# EAGLE design Digitizer10Bits (EAGLE 5.11)

## Sheet 1 of 4
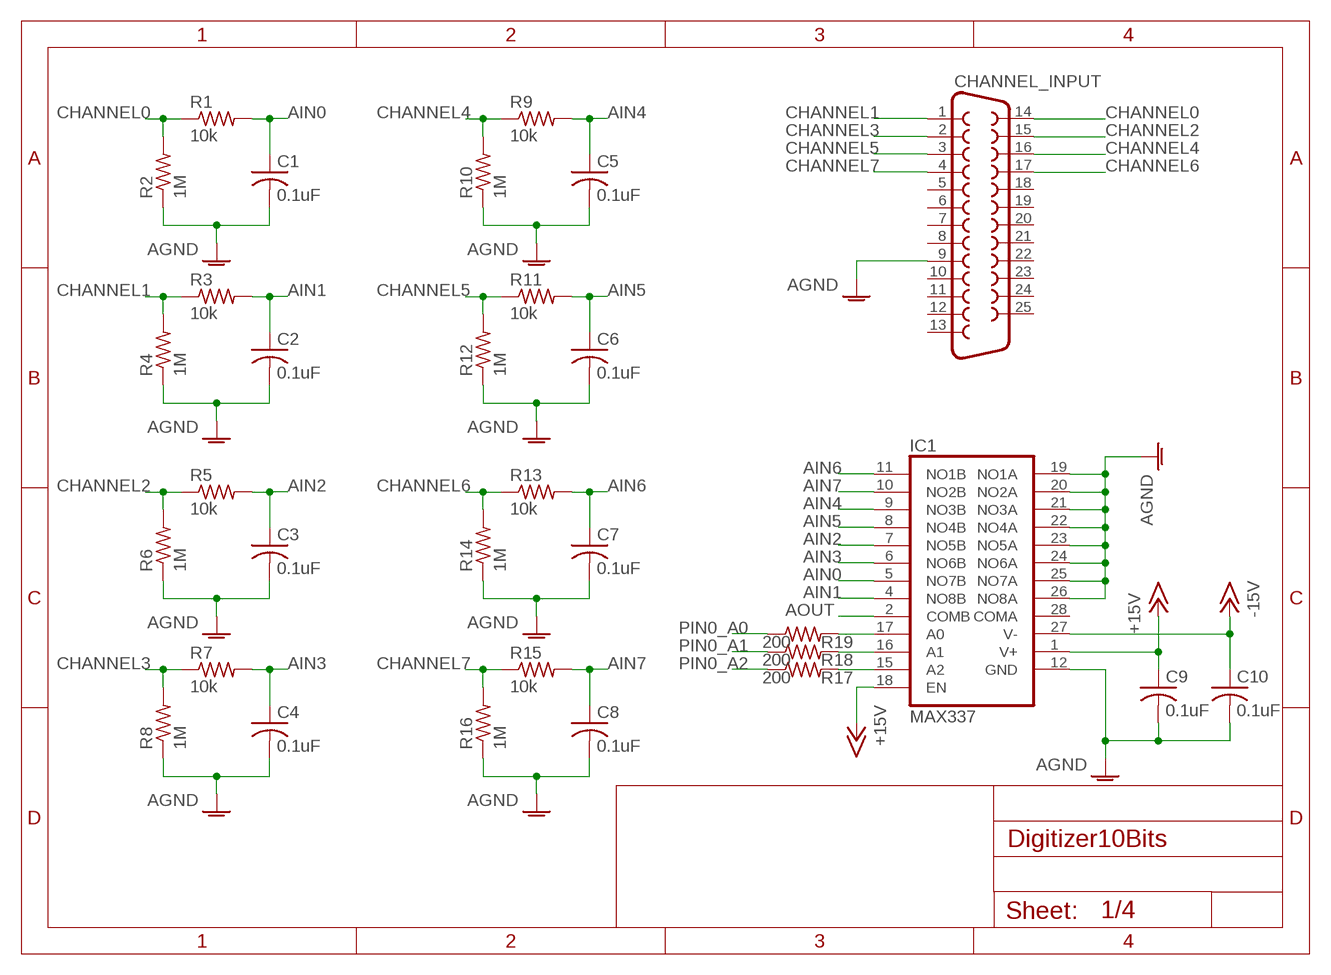
[diagram p0: schematic, sheet 1]

### Parts
C1  0.1uF  C-USC0603  [C0603]
C2  0.1uF  C-USC0603  [C0603]
C3  0.1uF  C-USC0603  [C0603]
C4  0.1uF  C-USC0603  [C0603]
C5  0.1uF  C-USC0603  [C0603]
C6  0.1uF  C-USC0603  [C0603]
C7  0.1uF  C-USC0603  [C0603]
C8  0.1uF  C-USC0603  [C0603]
C9  0.1uF  C-USC0603  [C0603]
C10  0.1uF  C-USC0603  [C0603]
CHANNEL_INPUT  F25HP  [F25HP]
IC1  MAX337  [SSOP28]
R1  10k  R-US_R0603  [R0603]
R2  1M  R-US_R0603  [R0603]
R3  10k  R-US_R0603  [R0603]
R4  1M  R-US_R0603  [R0603]
R5  10k  R-US_R0603  [R0603]
R6  1M  R-US_R0603  [R0603]
R7  10k  R-US_R0603  [R0603]
R8  1M  R-US_R0603  [R0603]
R9  10k  R-US_R0603  [R0603]
R10  1M  R-US_R0603  [R0603]
R11  10k  R-US_R0603  [R0603]
R12  1M  R-US_R0603  [R0603]
R13  10k  R-US_R0603  [R0603]
R14  1M  R-US_R0603  [R0603]
R15  10k  R-US_R0603  [R0603]
R16  1M  R-US_R0603  [R0603]
R17  200  R-US_R0603  [R0603]
R18  200  R-US_R0603  [R0603]
R19  200  R-US_R0603  [R0603]

### Nets
+15V: C9.1 IC1.1(V+) IC1.18(EN) ; also sheet 2,3
-15V: C10.1 IC1.27(V-) ; also sheet 2,3
AGND: C1.2 C2.2 C3.2 C4.2 C5.2 C6.2 C7.2 C8.2 C9.2 C10.2 CHANNEL_INPUT.9 IC1.12(GND) IC1.19(NO1A) IC1.20(NO2A) IC1.21(NO3A) IC1.22(NO4A) IC1.23(NO5A) IC1.24(NO6A) IC1.25(NO7A) IC1.26(NO8A) R2.1 R4.1 R6.1 R8.1 R10.1 R12.1 R14.1 R16.1 ; also sheet 2,3
AIN0: C1.1 IC1.5(NO7B) R1.2
AIN1: C2.1 IC1.4(NO8B) R3.2
AIN2: C3.1 IC1.7(NO5B) R5.2
AIN3: C4.1 IC1.6(NO6B) R7.2
AIN4: C5.1 IC1.9(NO3B) R9.2
AIN5: C6.1 IC1.8(NO4B) R11.2
AIN6: C7.1 IC1.11(NO1B) R13.2
AIN7: C8.1 IC1.10(NO2B) R15.2
AOUT: IC1.2(COMB) ; also sheet 3
CHANNEL0: CHANNEL_INPUT.14 R1.1 R2.2
CHANNEL1: CHANNEL_INPUT.1 R3.1 R4.2
CHANNEL2: CHANNEL_INPUT.15 R5.1 R6.2
CHANNEL3: CHANNEL_INPUT.2 R7.1 R8.2
CHANNEL4: CHANNEL_INPUT.16 R9.1 R10.2
CHANNEL5: CHANNEL_INPUT.3 R11.1 R12.2
CHANNEL6: CHANNEL_INPUT.17 R13.1 R14.2
CHANNEL7: CHANNEL_INPUT.4 R15.1 R16.2
N$1: IC1.15(A2) R17.2
N$2: IC1.16(A1) R18.2
N$3: IC1.17(A0) R19.2
PIN0_A0: R19.1 ; also sheet 3
PIN0_A1: R18.1 ; also sheet 3
PIN0_A2: R17.1 ; also sheet 3
Unconnected: CHANNEL_INPUT.5 CHANNEL_INPUT.6 CHANNEL_INPUT.7 CHANNEL_INPUT.8 CHANNEL_INPUT.10 CHANNEL_INPUT.11 CHANNEL_INPUT.12 CHANNEL_INPUT.13 CHANNEL_INPUT.18 CHANNEL_INPUT.19 CHANNEL_INPUT.20 CHANNEL_INPUT.21 CHANNEL_INPUT.22 CHANNEL_INPUT.23 CHANNEL_INPUT.24 CHANNEL_INPUT.25 IC1.28(COMA)

## Sheet 2 of 4
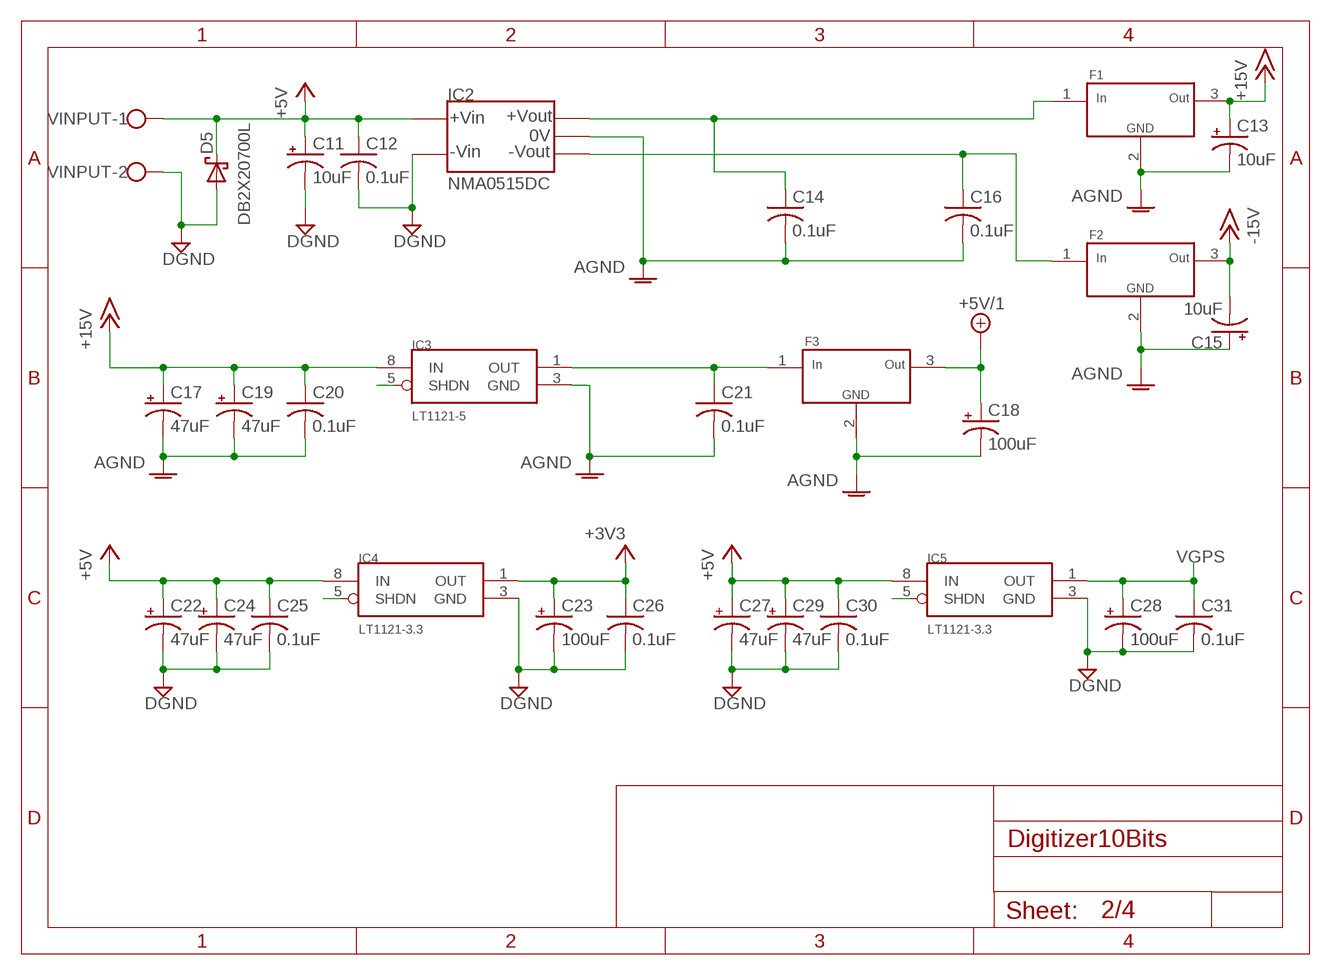
[diagram p1: schematic, sheet 2]

### Parts
C11  10uF  CPOL-USA/3216-18W  [A/3216-18W]
C12  0.1uF  C-USC0603  [C0603]
C13  10uF  CPOL-USA/3216-18W  [A/3216-18W]
C14  0.1uF  C-USC0603  [C0603]
C15  10uF  CPOL-USA/3216-18W  [A/3216-18W]
C16  0.1uF  C-USC0603  [C0603]
C17  47uF  CPOL-USE  [PANASONIC_E]
C18  100uF  CPOL-USE  [PANASONIC_E]
C19  47uF  CPOL-USE  [PANASONIC_E]
C20  0.1uF  C-USC0603  [C0603]
C21  0.1uF  C-USC0603  [C0603]
C22  47uF  CPOL-USE  [PANASONIC_E]
C23  100uF  CPOL-USE  [PANASONIC_E]
C24  47uF  CPOL-USE  [PANASONIC_E]
C25  0.1uF  C-USC0603  [C0603]
C26  0.1uF  C-USC0603  [C0603]
C27  47uF  CPOL-USE  [PANASONIC_E]
C28  100uF  CPOL-USE  [PANASONIC_E]
C29  47uF  CPOL-USE  [PANASONIC_E]
C30  0.1uF  C-USC0603  [C0603]
C31  0.1uF  C-USC0603  [C0603]
D5  DB2X20700L  SCHOTTKY_SMD  [DIODE_PW]
F1  EMIFIL  [NFE-2706]
F2  EMIFIL  [NFE-2706]
F3  EMIFIL  [NFE-2706]
IC2  NMA0515DC  NMA1512DC  [NMA1512DC]
IC3  LT1121-5  LT1121-3.3  [SO08]
IC4  LT1121-3.3  [SO08]
IC5  LT1121-3.3  [SO08]
VINPUT  W237-102  [W237-102]

### Nets
+3V3: C23.+ C26.1 IC4.1(OUT) ; also sheet 3,4
+5V: C11.+ C12.1 C22.+ C24.+ C25.1 C27.+ C29.+ C30.1 D5.K(C) IC2.+VIN IC4.8(IN) IC5.8(IN) VINPUT.1
+5V/1: C18.+ F3.3 ; also sheet 3
+15V: C13.+ C17.+ C19.+ C20.1 F1.3 IC3.8(IN) ; also sheet 1,3
-15V: C15.- F2.3 ; also sheet 1,3
AGND: C13.- C14.2 C15.+ C16.2 C17.- C18.- C19.- C20.2 C21.2 F1.2 F2.2 F3.2 IC2.0V IC3.3(GND) ; also sheet 1,3
DGND: C11.- C12.2 C22.- C23.- C24.- C25.2 C26.2 C27.- C28.- C29.- C30.2 C31.2 D5.A IC2.-VIN IC4.3(GND) IC5.3(GND) VINPUT.2 ; also sheet 3,4
N$24: IC3.5(SHDN)
N$39: C14.1 F1.1 IC2.+VOUT
N$40: C16.1 F2.1 IC2.-VOUT
N$42: C21.1 F3.1 IC3.1(OUT)
N$48: IC4.5(SHDN)
N$52: IC5.5(SHDN)
VGPS: C28.+ C31.1 IC5.1(OUT) ; also sheet 4

## Sheet 3 of 4
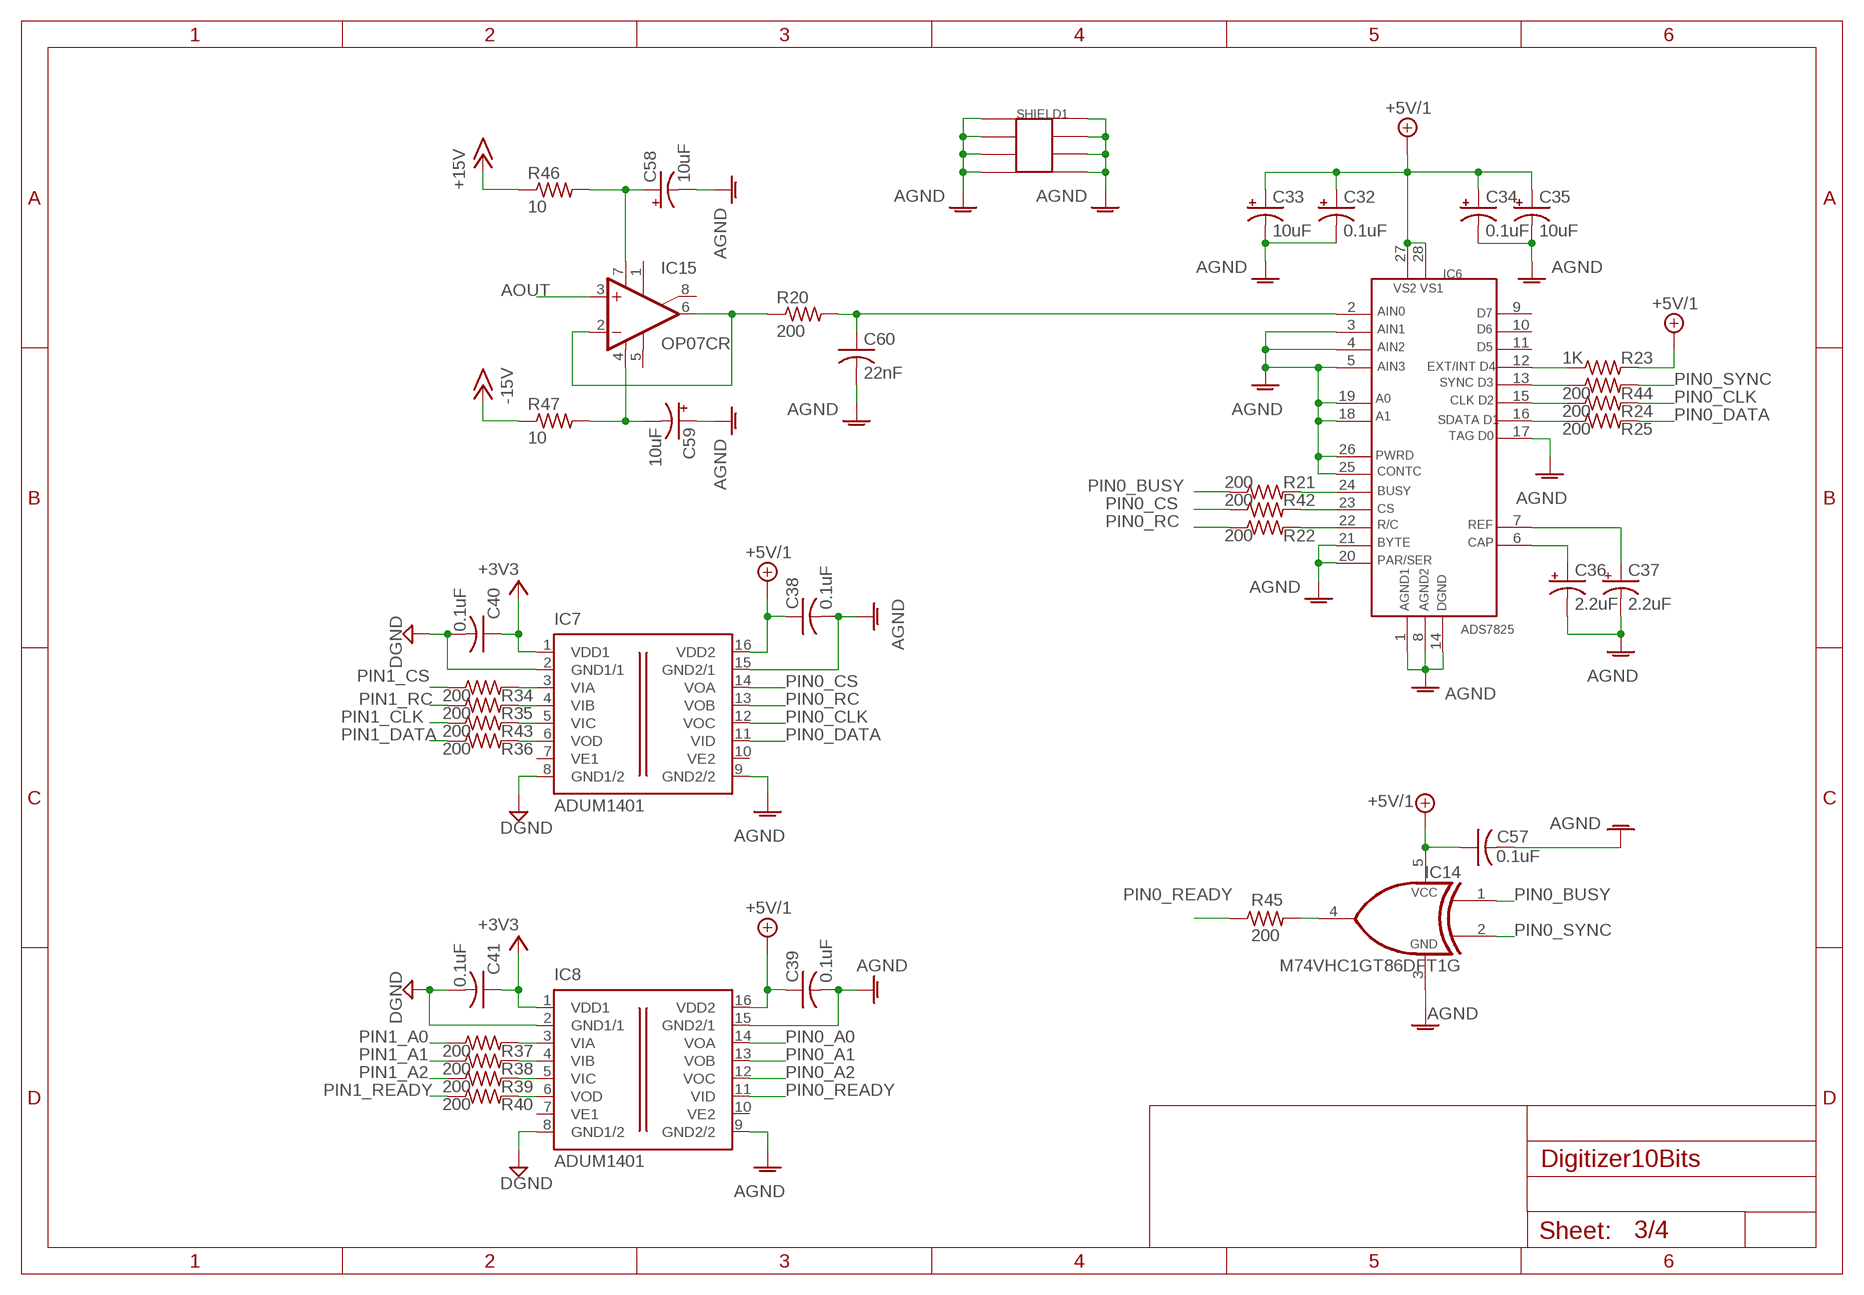
[diagram p2: schematic, sheet 3]

### Parts
C32  0.1uF  CPOL-USA/3216-18W  [A/3216-18W]
C33  10uF  CPOL-USA/3216-18W  [A/3216-18W]
C34  0.1uF  CPOL-USA/3216-18W  [A/3216-18W]
C35  10uF  CPOL-USA/3216-18W  [A/3216-18W]
C36  2.2uF  CPOL-USA/3216-18W  [A/3216-18W]
C37  2.2uF  CPOL-USA/3216-18W  [A/3216-18W]
C38  0.1uF  C-USC0603  [C0603]
C39  0.1uF  C-USC0603  [C0603]
C40  0.1uF  C-USC0603  [C0603]
C41  0.1uF  C-USC0603  [C0603]
C57  0.1uF  C-USC0603  [C0603]
C58  10uF  CPOL-USA/3216-18W  [A/3216-18W]
C59  10uF  CPOL-USA/3216-18W  [A/3216-18W]
C60  22nF  C-USC0603  [C0603]
IC6  ADS7825  [SOIC-28]
IC7  ADUM1401  [SO-16W]
IC8  ADUM1401  [SO-16W]
IC14  M74VHC1GT86DFT1G  M74GT86DFT1G  [SOT-353]
IC15  OP07CR  [SO08]
R20  200  R-US_R0603  [R0603]
R21  200  R-US_R0603  [R0603]
R22  200  R-US_R0603  [R0603]
R23  1K  R-US_R0603  [R0603]
R24  200  R-US_R0603  [R0603]
R25  200  R-US_R0603  [R0603]
R34  200  R-US_R0603  [R0603]
R35  200  R-US_R0603  [R0603]
R36  200  R-US_R0603  [R0603]
R37  200  R-US_R0603  [R0603]
R38  200  R-US_R0603  [R0603]
R39  200  R-US_R0603  [R0603]
R40  200  R-US_R0603  [R0603]
R42  200  R-US_R0603  [R0603]
R43  200  R-US_R0603  [R0603]
R44  200  R-US_R0603  [R0603]
R45  200  R-US_R0603  [R0603]
R46  10  R-US_R0805  [R0805]
R47  10  R-US_R0805  [R0805]
SHIELD1  SHIELD_50X38  [SHIELD_38X50]

### Nets
+3V3: C40.1 C41.1 IC7.1(VDD1) IC8.1(VDD1) ; also sheet 2,4
+5V/1: C32.+ C33.+ C34.+ C35.+ C38.1 C39.1 C57.1 IC6.27 IC6.28 IC7.16(VDD2) IC8.16(VDD2) IC14.5 R23.2 ; also sheet 2
+15V: R46.1 ; also sheet 1,2
-15V: R47.1 ; also sheet 1,2
AGND: C32.- C33.- C34.- C35.- C36.- C37.- C38.2 C39.2 C57.2 C58.- C59.+ C60.2 IC6.1 IC6.3 IC6.4 IC6.5 IC6.8 IC6.14 IC6.17 IC6.18 IC6.19 IC6.20 IC6.21 IC6.25 IC6.26 IC7.9(GND2/2) IC7.15(GND2/1) IC8.9(GND2/2) IC8.15(GND2/1) IC14.3 SHIELD1.P$1 SHIELD1.P$2 SHIELD1.P$3 SHIELD1.P$4 SHIELD1.P$5 SHIELD1.P$6 SHIELD1.P$7 SHIELD1.P$8 ; also sheet 1,2
AOUT: IC15.3(+IN) ; also sheet 1
DGND: C40.2 C41.2 IC7.2(GND1/1) IC7.8(GND1/2) IC8.2(GND1/1) IC8.8(GND1/2) ; also sheet 2,4
N$4: IC6.24 R21.2
N$6: IC6.22 R22.2
N$7: C60.1 IC6.2 R20.2
N$12: IC6.12 R23.1
N$13: IC6.15 R24.1
N$14: IC6.16 R25.1
N$17: C36.+ IC6.6
N$18: C37.+ IC6.7
N$28: IC7.3(VIA) R34.2
N$29: IC7.4(VIB) R35.2
N$30: IC7.6(VOD) R36.2
N$31: IC8.3(VIA) R37.2
N$32: IC8.4(VIB) R38.2
N$33: IC8.5(VIC) R39.2
N$34: IC8.6(VOD) R40.2
N$37: C59.- IC15.4(V-) R47.2
N$41: IC6.23 R42.2
N$43: IC7.5(VIC) R43.2
N$44: IC14.4 R45.2
N$45: C58.+ IC15.7(V+) R46.2
N$46: IC6.13 R44.1
N$47: IC15.2(-IN) IC15.6(OUT) R20.1
PIN0_A0: IC8.14(VOA) ; also sheet 1
PIN0_A1: IC8.13(VOB) ; also sheet 1
PIN0_A2: IC8.12(VOC) ; also sheet 1
PIN0_BUSY: IC14.1 R21.1
PIN0_CLK: IC7.12(VOC) R24.2
PIN0_CS: IC7.14(VOA) R42.1
PIN0_DATA: IC7.11(VID) R25.2
PIN0_RC: IC7.13(VOB) R22.1
PIN0_READY: IC8.11(VID) R45.1
PIN0_SYNC: IC14.2 R44.2
PIN1_A0: R37.1 ; also sheet 4
PIN1_A1: R38.1 ; also sheet 4
PIN1_A2: R39.1 ; also sheet 4
PIN1_CLK: R43.1 ; also sheet 4
PIN1_CS: R34.1 ; also sheet 4
PIN1_DATA: R36.1 ; also sheet 4
PIN1_RC: R35.1 ; also sheet 4
PIN1_READY: R40.1 ; also sheet 4
Unconnected: IC6.9 IC6.10 IC6.11 IC7.7(VE1) IC7.10(VE2) IC8.7(VE1) IC8.10(VE2) IC15.1(ON1) IC15.5(OPT) IC15.8(ON2)

## Sheet 4 of 4
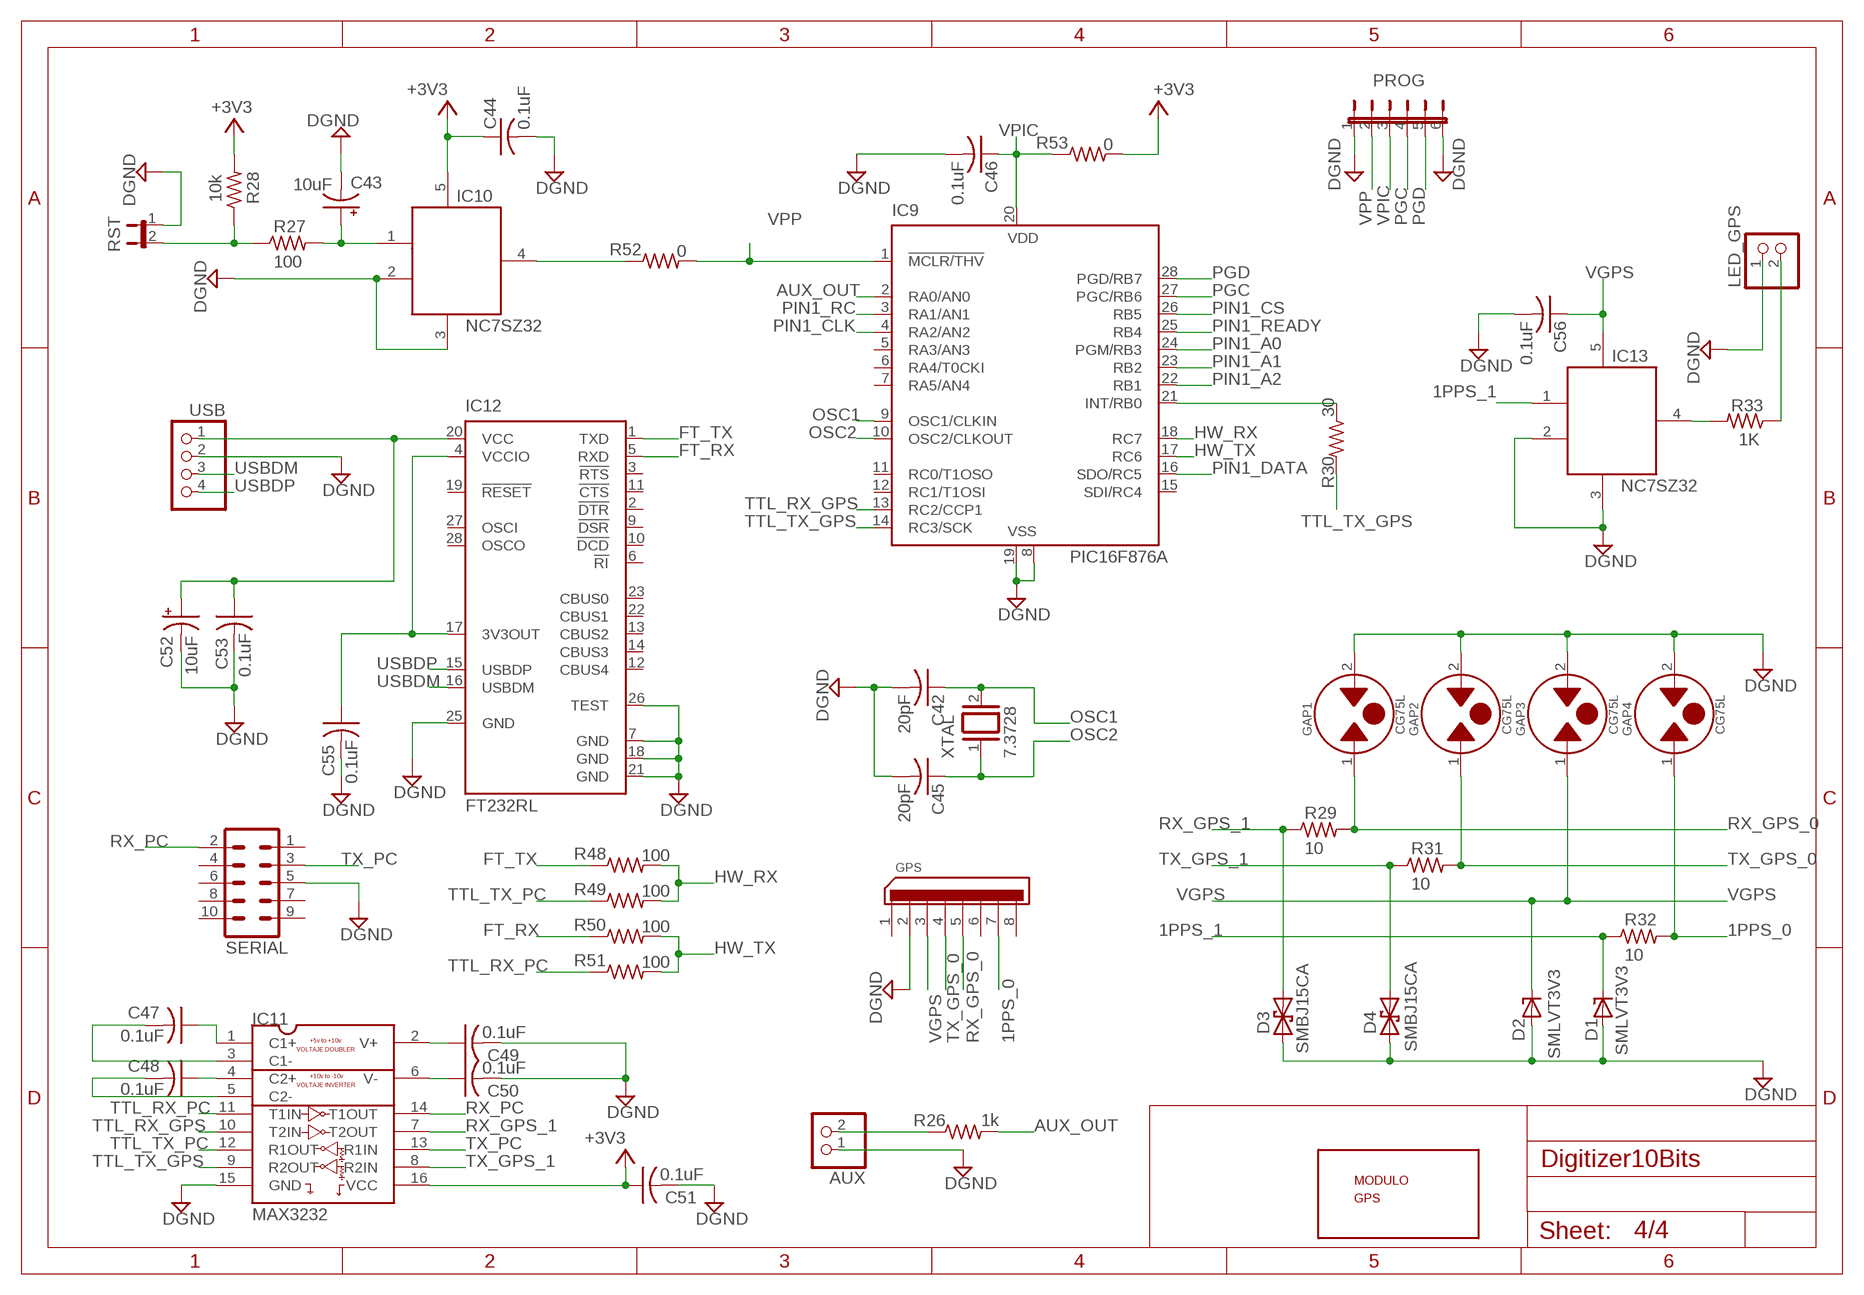
[diagram p3: schematic, sheet 4]

### Parts
AUX  PINHD-1X2  [1X02]
C42  20pF  C-USC0603  [C0603]
C43  10uF  CPOL-USA/3216-18W  [A/3216-18W]
C44  0.1uF  C-USC0603  [C0603]
C45  20pF  C-USC0603  [C0603]
C46  0.1uF  C-USC0603  [C0603]
C47  0.1uF  C-USC0603  [C0603]
C48  0.1uF  C-USC0603  [C0603]
C49  0.1uF  C-USC0603  [C0603]
C50  0.1uF  C-USC0603  [C0603]
C51  0.1uF  C-USC0603  [C0603]
C52  10uF  CPOL-USA/3216-18W  [A/3216-18W]
C53  0.1uF  C-USC0603  [C0603]
C55  0.1uF  C-USC0603  [C0603]
C56  0.1uF  C-USC0603  [C0603]
D1  SMLVT3V3  [SMLVT3V3]
D2  SMLVT3V3  [SMLVT3V3]
D3  SMBJ15CA  MSBJ15CA  [DIODE_KK2]
D4  SMBJ15CA  MSBJ15CA  [DIODE_KK2]
GAP1  CG75L  [GAP]
GAP2  CG75L  [GAP]
GAP3  CG75L  [GAP]
GAP4  CG75L  [GAP]
GPS  MOLEX_FLEX8  [MOLEX_FLEX8PIN]
IC9  PIC16F876A  PIC16F876SO  [SO28W]
IC10  NC7SZ32  NC7S32  [SOT-23-5]
IC11  MAX3232  [SOIC16N]
IC12  FT232RL  [SSOP28]
IC13  NC7SZ32  NC7S32  [SOT-23-5]
LED_GPS  PINHD-1X2  [1X02]
MODGPS1  GPS15LF  [GPS15LF]
PROG  HEADER_SMD_6  [HEADER_SMD_6]
R26  1k  R-US_R0603  [R0603]
R27  100  R-US_R0603  [R0603]
R28  10k  R-US_R0603  [R0603]
R29  10  R-US_R0805  [R0805]
R30  30  R-US_R0603  [R0603]
R31  10  R-US_R0805  [R0805]
R32  10  R-US_R0805  [R0805]
R33  1K  R-US_R0603  [R0603]
R48  100  R-US_R0603  [R0603]
R49  100  R-US_R0603  [R0603]
R50  100  R-US_R0603  [R0603]
R51  100  R-US_R0603  [R0603]
R52  0  R-US_R0603  [R0603]
R53  0  R-US_R0603  [R0603]
RST  HEADER_SMD_2  [HEADER_SMD_2]
SERIAL  ML10  [ML10]
USB  PINHD-1X4  [1X04]
XTAL  7.3728  CRYSTAL_SMD  [CRYSTAL_SMD]

### Nets
1PPS_0: GAP4.1 GPS.7 R32.2
1PPS_1: D1.K(C) IC13.1(IN1) R32.1
+3V3: C44.1 C51.1 IC10.5(1_VCC) IC11.16(VCC) R28.2 R53.2 ; also sheet 2,3
AUX_OUT: IC9.2(RA0/AN0) R26.2
DGND: AUX.1 C42.2 C43.- C44.2 C45.2 C46.2 C49.2 C50.2 C51.2 C52.- C53.2 C55.2 C56.2 D1.A D2.A D3.A1 D4.A1 GAP1.2 GAP2.2 GAP3.2 GAP4.2 GPS.2 IC9.8(VSS) IC9.19(VSS) IC10.2(IN2) IC10.3(1_GND) IC11.15(GND) IC12.7(GND) IC12.18(GND) IC12.21(GND) IC12.25(GND) IC12.26(TEST) IC13.2(IN2) IC13.3(1_GND) LED_GPS.1 PROG.1 PROG.6 RST.1 SERIAL.5 USB.2 ; also sheet 2,3
FT_RX: IC12.5(RXD) R50.1
FT_TX: IC12.1(TXD) R48.1
HW_RX: IC9.18(RC7) R48.2 R49.2
HW_TX: IC9.17(RC6) R50.2 R51.2
N$5: R27.1 R28.1 RST.2
N$8: IC10.4(OUT) R52.1
N$9: C43.+ IC10.1(IN1) R27.2
N$10: C55.1 IC12.4(VCCIO) IC12.17(3V3OUT)
N$11: C47.1 IC11.1(C1+)
N$15: C47.2 IC11.3(C1-)
N$16: C48.1 IC11.4(C2+)
N$19: C48.2 IC11.5(C2-)
N$20: AUX.2 R26.1
N$21: IC9.21(INT/RB0) R30.1
N$26: LED_GPS.2 R33.1
N$27: IC13.4(OUT) R33.2
N$38: C49.1 IC11.2(V+)
N$51: C50.1 IC11.6(V-)
OSC1: C42.1 IC9.9(OSC1/CLKIN) XTAL.2
OSC2: C45.1 IC9.10(OSC2/CLKOUT) XTAL.1
PGC: IC9.27(PGC/RB6) PROG.4
PGD: IC9.28(PGD/RB7) PROG.5
PIN1_A0: IC9.24(PGM/RB3) ; also sheet 3
PIN1_A1: IC9.23(RB2) ; also sheet 3
PIN1_A2: IC9.22(RB1) ; also sheet 3
PIN1_CLK: IC9.4(RA2/AN2) ; also sheet 3
PIN1_CS: IC9.26(RB5) ; also sheet 3
PIN1_DATA: IC9.16(SDO/RC5) ; also sheet 3
PIN1_RC: IC9.3(RA1/AN1) ; also sheet 3
PIN1_READY: IC9.25(RB4) ; also sheet 3
RX_GPS_0: GAP1.1 GPS.5 R29.2
RX_GPS_1: D3.A2 IC11.7(T2OUT) R29.1
RX_PC: IC11.14(T1OUT) SERIAL.2
TTL_RX_GPS: IC9.13(RC2/CCP1) IC11.10(T2IN)
TTL_RX_PC: IC11.11(T1IN) R51.1
TTL_TX_GPS: IC9.14(RC3/SCK) IC11.9(R2OUT) R30.2
TTL_TX_PC: IC11.12(R1OUT) R49.1
TX_GPS_0: GAP2.1 GPS.4 R31.2
TX_GPS_1: D4.A2 IC11.8(R2IN) R31.1
TX_PC: IC11.13(R1IN) SERIAL.3
USBDM: IC12.16(USBDM) USB.3
USBDP: IC12.15(USBDP) USB.4
VGPS: C56.1 D2.K(C) GAP3.1 GPS.3 IC13.5(1_VCC) ; also sheet 2
VPIC: C46.1 IC9.20(VDD) PROG.3 R53.1
VPP: IC9.1(!MCLR/THV) PROG.2 R52.2
VUSB: C52.+ C53.1 IC12.20(VCC) USB.1
Unconnected: GPS.1 GPS.6 GPS.8 IC9.5(RA3/AN3) IC9.6(RA4/T0CKI) IC9.7(RA5/AN4) IC9.11(RC0/T1OSO) IC9.12(RC1/T1OSI) IC9.15(SDI/RC4) IC12.2(!DTR) IC12.3(!RTS) IC12.6(!RI) IC12.9(!DSR) IC12.10(!DCD) IC12.11(!CTS) IC12.12(CBUS4) IC12.13(CBUS2) IC12.14(CBUS3) IC12.19(!RESET) IC12.22(CBUS1) IC12.23(CBUS0) IC12.27(OSCI) IC12.28(OSCO) SERIAL.1 SERIAL.4 SERIAL.6 SERIAL.7 SERIAL.8 SERIAL.9 SERIAL.10

## Library data of the parts
AUX LED_GPS = pinhead:PINHD-1X2: PIN HEADER
C1-C10 C12 C14 C16 C20 C21 C25 C26 C30 C31 C38-C42 C44-C51 C53 C55-C57 C60 = rcl:C-US: CAPACITOR, American symbol
C11 C13 C15 C17-C19 C22-C24 C27-C29 C32-C37 C43 C52 C58 C59 = rcl:CPOL-US: POLARIZED CAPACITOR, American symbol
CHANNEL_INPUT = con-subd:F25: SUB-D
D1 D2 = magnetometro:SMLVT3V3
D3 D4 = magnetometro:MSBJ15CA
D5 = magnetometro:SCHOTTKY_SMD
F1-F3 = magnetometro:EMIFIL
GAP1-GAP4 = magnetometro:CG75L
GPS = magnetometro:MOLEX_FLEX8
IC1 = Ricardo_Library:MAX337
IC2 = magnetometro:NMA1512DC
IC3-IC5 = Ricardo_Library:LT1121-3.3
IC6 = magnetometro:ADS7825
IC7 IC8 = Ricardo_Library:ADUM1401
IC9 = Ricardo_Library:PIC16F876SO
IC10 IC13 = magnetometro:NC7S32
IC11 = Ricardo_Library:MAX3232
IC12 = ftdichip:FT232R: Source: http://www.ftdichip.com/Documents/DataSheets/DS_FT232R_v104.pdf
IC14 = magnetometro:M74GT86DFT1G
IC15 = linear:OP07*: OP AMP
MODGPS1 = magnetometro:GPS15LF
PROG = Ricardo_Library:HEADER_SMD_6
R1-R40 R42-R53 = rcl:R-US_: RESISTOR, American symbol
RST = Ricardo_Library:HEADER_SMD_2
SERIAL = con-harting-ml:ML10: HARTING; OC_FARNELL: unknown; OC_NEWARK: unknown
SHIELD1 = magnetometro:SHIELD_50X38
USB = pinhead:PINHD-1X4: PIN HEADER
VINPUT = con-wago-500:W237-102: WAGO SCREW CLAMP; MPN: 237-102; OC_FARNELL: unknown; OC_NEWARK: 70K9898
XTAL = Ricardo_Library:CRYSTAL_SMD

## Board
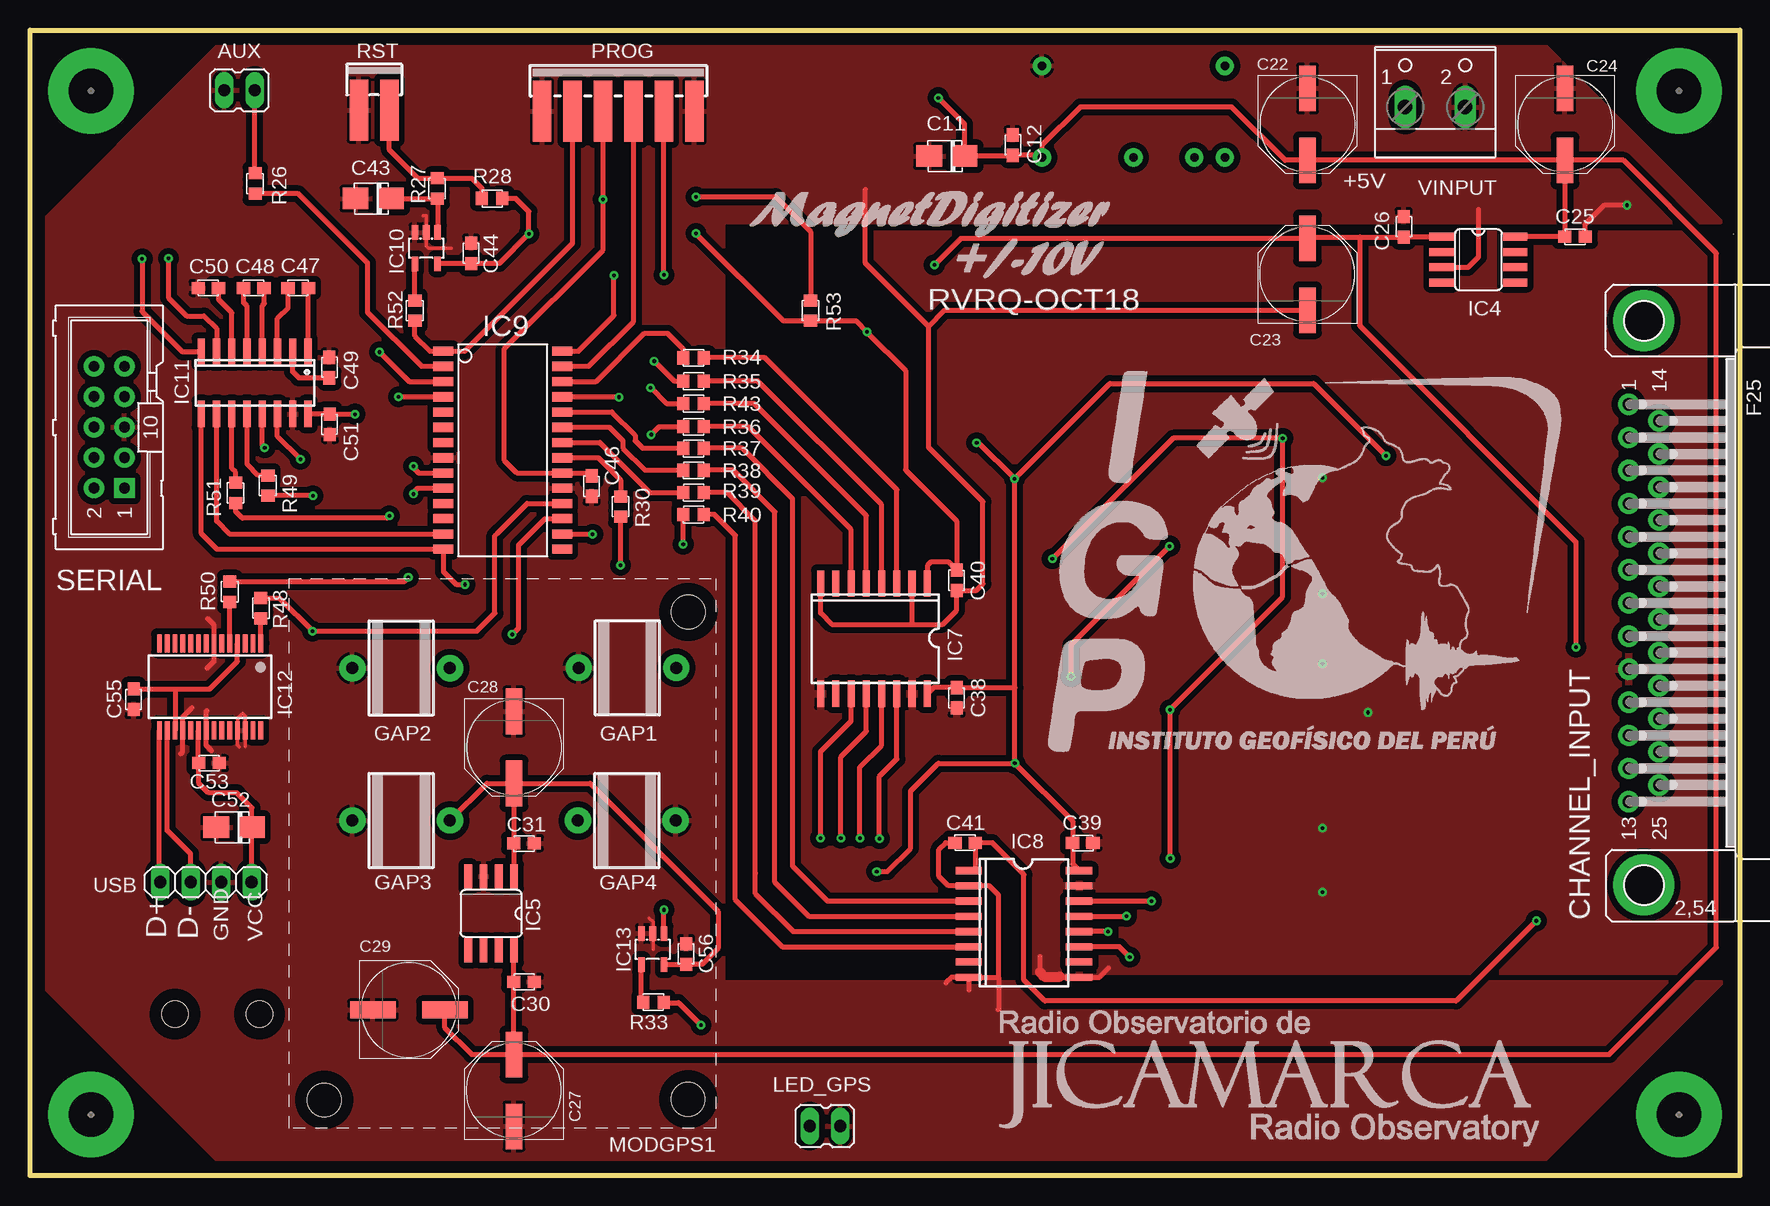
[diagram p4: board, top side]
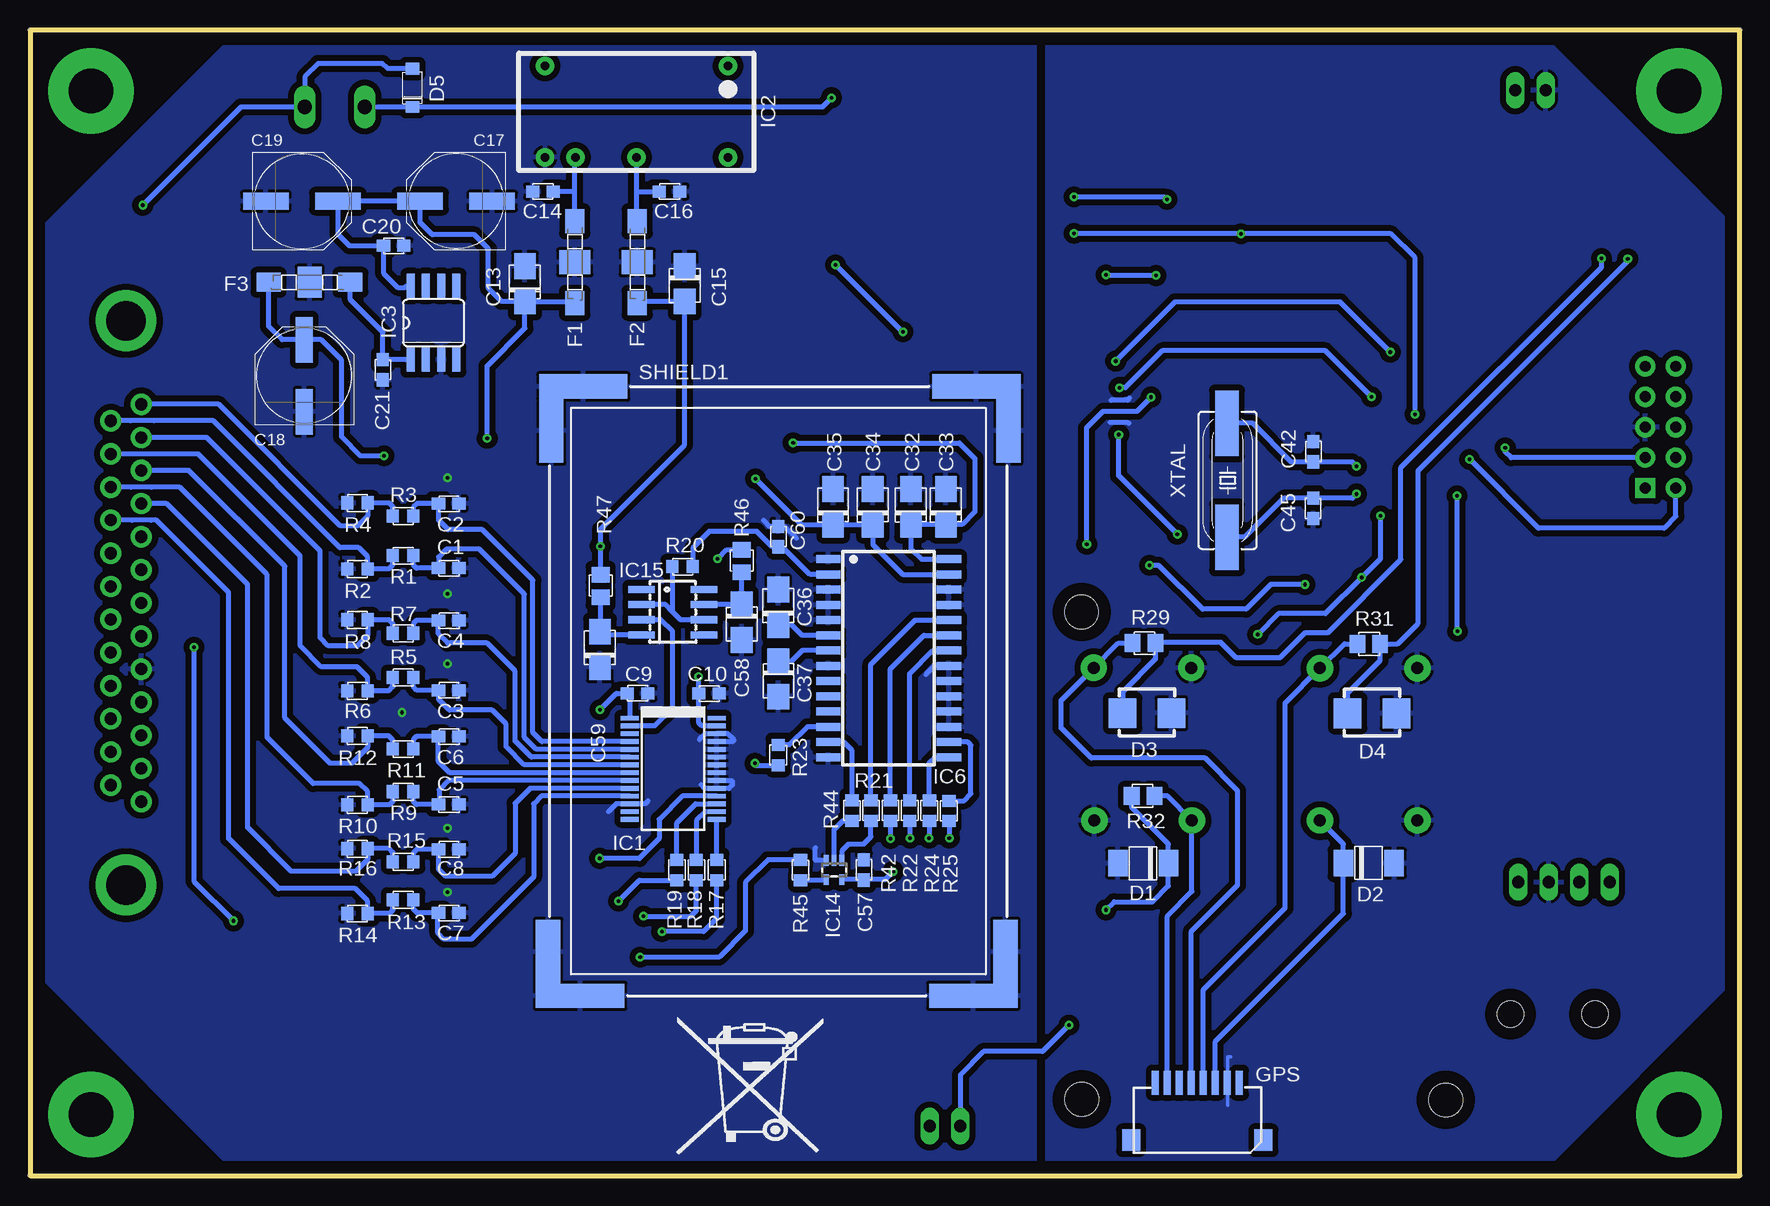
[diagram p5: board, bottom side, seen from below]

Size 142.49 x 95.5 mm. Coordinates in mm from the lower left corner, seen from the top.
Outline: 0,0 0,95.5 142.49,95.5 142.49,0 0,0
Copper layers (1*16): Top 0.035mm / dielectric 1.5mm / Bottom 0.035mm
Design rules "default": minimum track width 10mil, minimum drill 24mil, track to track 8mil, track to pad 8mil, pad to pad 8mil, via to via 8mil, smd to smd 8mil, copper to edge 40mil, drill to drill 8mil, minimum pad ring 10mil, minimum via ring 8mil, stop-mask expansion 4mil, vias tented up to drill 0mil, thermal gap 10mil
Holes 2.2 mm at 12.09,13.46 19.13,13.46

### Footprints (pad centres in the part's own frame; a part is rotated, then mirrored left to right if it is on the bottom)
1X02 = drill 1.016 long: 1 -1.27,0; 2 1.27,0
C0603 = smd 1.1 x 1: 1 -0.85,0; 2 0.85,0
A/3216-18W = smd 2.15 x 1.8: + 1.475,0; - -1.475,0
PANASONIC_E = smd 3.8 x 1.4: + 3,0; - -3,0
F25HP = drill 1.016 pad 1.778 round: 1 -16.561,-1.27; 2 -13.792,-1.27; 3 -11.049,-1.27; 4 -8.28,-1.27; 5 -5.512,-1.27; 6 -2.769,-1.27; 7 0,-1.27; 8 2.769,-1.27; 9 5.512,-1.27; 10 8.28,-1.27; 11 11.049,-1.27; 12 13.792,-1.27; 13 16.561,-1.27; 14 -15.189,1.27; 15 -12.421,1.27; 16 -9.652,1.27; 17 -6.909,1.27; 18 -4.14,1.27; 19 -1.372,1.27; 20 1.372,1.27; 21 4.14,1.27; 22 6.909,1.27; 23 9.652,1.27; 24 12.421,1.27; 25 15.189,1.27 | drill 3.302 pad 5.08 round: G1 -23.52,0; G2 23.52,0
SMLVT3V3 = smd 1.62 x 2.18: A -2.11,0; K 2.11,0
DIODE_KK2 = smd 2.286 x 2.489: A1 -2.286,-0.508; A2 1.778,-0.508
DIODE_PW = smd 1.1 x 0.9: A 0,-1.6; K 0,1.6
NFE-2706 = smd 2 x 1.6: 1 -3.4,0; 3 3.4,0 | smd 2 x 2.6: 2 0,0
GAP = drill 1 pad 2.184 round: 1 -4.064,0; 2 4.064,0
MOLEX_FLEX8PIN = smd 0.6 x 2: 1 -3.19,-2.54; 2 -2.19,-2.54; 3 -1.19,-2.54; 4 -0.19,-2.54; 5 0.81,-2.54; 6 1.81,-2.54; 7 2.81,-2.54; 8 3.81,-2.54 | smd 1.5 x 1.8: NC1 -5.19,2.26; NC2 5.835,2.258
SSOP28 = smd 0.4 x 1.5: 1 -4.225,-3.625; 2 -3.575,-3.625; 3 -2.925,-3.625; 4 -2.275,-3.625; 5 -1.625,-3.625; 6 -0.975,-3.625; 7 -0.325,-3.625; 8 0.325,-3.625; 9 0.975,-3.625; 10 1.625,-3.625; 11 2.275,-3.625; 12 2.925,-3.625; 13 3.575,-3.625; 14 4.225,-3.625; 15 4.225,3.625; 16 3.575,3.625; 17 2.925,3.625; 18 2.275,3.625; 19 1.625,3.625; 20 0.975,3.625; 21 0.325,3.625; 22 -0.325,3.625; 23 -0.975,3.625; 24 -1.625,3.625; 25 -2.275,3.625; 26 -2.925,3.625; 27 -3.575,3.625; 28 -4.225,3.625
NMA1512DC = drill 0.7 pad 1.524 round: 0V 17.374,8.687; +VIN 2.134,8.687; +VOUT 14.834,8.687; -VIN 2.134,1.067; -VOUT 9.754,8.687; NC 17.374,1.067
SO08 = smd 0.66 x 2.032: 1 -1.905,-3.073; 2 -0.635,-3.073; 3 0.635,-3.073; 4 1.905,-3.073; 5 1.905,3.073; 6 0.635,3.073; 7 -0.635,3.073; 8 -1.905,3.073
SOIC-28 = smd 0.66 x 2.032: 1 -6.934,-4.978; 2 -5.664,-4.978; 3 -4.394,-4.978; 4 -3.124,-4.978; 5 -1.854,-4.978; 6 -0.584,-4.978; 7 0.686,-4.978; 8 1.956,-4.978; 9 3.226,-4.978; 10 4.496,-4.978; 11 5.766,-4.978; 12 7.036,-4.978; 13 8.306,-4.978; 14 9.576,-4.978; 15 9.576,5.08; 16 8.306,5.08; 17 7.036,5.08; 18 5.766,5.08; 19 4.496,5.08; 20 3.226,5.08; 21 1.956,5.08; 22 0.686,5.08; 23 -0.584,5.08; 24 -1.854,5.08; 25 -3.124,5.08; 26 -4.394,5.08; 27 -5.664,5.08; 28 -6.934,5.08
SO-16W = smd 0.6 x 2.2: 1 -4.445,-4.6; 2 -3.175,-4.6; 3 -1.905,-4.6; 4 -0.635,-4.6; 5 0.635,-4.6; 6 1.905,-4.6; 7 3.175,-4.6; 8 4.445,-4.6; 9 4.445,4.6; 10 3.175,4.6; 11 1.905,4.6; 12 0.635,4.6; 13 -0.635,4.6; 14 -1.905,4.6; 15 -3.175,4.6; 16 -4.445,4.6
SO28W = smd 0.762 x 1.651: 1 -7.62,-4.958; 2 -6.35,-4.958; 3 -5.08,-4.958; 4 -3.81,-4.958; 5 -2.54,-4.958; 6 -1.27,-4.958; 7 0,-4.958; 8 1.27,-4.958; 9 2.54,-4.958; 10 3.81,-4.958; 11 5.08,-4.958; 12 6.35,-4.958; 13 7.62,-4.958; 14 8.89,-4.958; 15 8.89,4.958; 16 7.62,4.958; 17 6.35,4.958; 18 5.08,4.958; 19 3.81,4.958; 20 2.54,4.958; 21 1.27,4.958; 22 0,4.958; 23 -1.27,4.958; 24 -2.54,4.958; 25 -3.81,4.958; 26 -5.08,4.958; 27 -6.35,4.958; 28 -7.62,4.958
SOT-23-5 = smd 1.2 x 0.55: 1 1.3,-0.95; 2 1.3,0; 3 1.3,0.95; 4 -1.3,0.95; 5 -1.3,-0.95
SOIC16N = smd 0.6 x 2.2: 1 -3.302,-3.032; 2 -2.032,-3.032; 3 -0.762,-3.032; 4 0.508,-3.032; 5 1.778,-3.032; 6 3.048,-3.032; 7 4.318,-3.032; 8 5.588,-3.032; 9 5.588,2.168; 10 4.318,2.168; 11 3.048,2.168; 12 1.778,2.168; 13 0.508,2.168; 14 -0.762,2.168; 15 -2.032,2.168; 16 -3.302,2.168
SOT-353 = smd 0.4 x 0.9: 1 -0.65,-0.8; 2 0,-0.8; 3 0.65,-0.8; 4 0.65,0.8; 5 -0.65,0.8
SO08' = smd 0.6 x 2.2: 1 -1.905,-2.6; 2 -0.635,-2.6; 3 0.635,-2.6; 4 1.905,-2.6; 5 1.905,2.6; 6 0.635,2.6; 7 -0.635,2.6; 8 -1.905,2.6
GPS15LF = hole 2.8: 33.274,-2.794; 33.249,-43.434; 2.921,-43.485
HEADER_SMD_6 = smd 5.08 x 1.524: 1 0,-6.35; 2 0,-3.81; 3 0,-1.27; 4 0,1.27; 5 0,3.81; 6 0,6.35
R0603 = smd 1 x 1.1: 1 -0.85,0; 2 0.85,0
R0805 = smd 1.3 x 1.5: 1 -0.95,0; 2 0.95,0
HEADER_SMD_2 = smd 5.08 x 1.524: 1 2.54,-1.27; 2 2.54,1.27
ML10 = drill 0.914 pad 1.676 square: 1 -5.08,-1.27 | drill 0.914 pad 1.676 round: 2 -5.08,1.27; 3 -2.54,-1.27; 4 -2.54,1.27; 5 0,-1.27; 6 0,1.27; 7 2.54,-1.27; 8 2.54,1.27; 9 5.08,-1.27; 10 5.08,1.27
SHIELD_38X50 = smd 7.366 x 2.032: P$1 2.54,0; P$2 35.306,0; P$3 35.56,50.8; P$4 2.794,50.8 | smd 2.032 x 5.334: P$5 0.127,47.117; P$6 -0.127,3.683; P$7 37.973,3.683; P$8 38.227,47.117
1X04 = drill 1.016 long: 1 -3.81,0; 2 -1.27,0; 3 1.27,0; 4 3.81,0
W237-102 = drill 1.194 long: 1 -2.5,-1.27; 2 2.5,-1.27
CRYSTAL_SMD = smd 5.486 x 1.981: 1 -4.75,0; 2 4.75,0

### Placement (x,y rotation side)
AUX  17.45,90.47 0 top
C1  107.59,50.65 0 bottom
C2  107.59,56.03 0 bottom
C3  107.59,40.46 0 bottom
C4  107.59,46.28 0 bottom
C5  107.59,30.94 0 bottom
C6  107.59,36.6 0 bottom
C7  107.59,21.89 0 bottom
C8  107.59,27.2 0 bottom
C9  91.87,40.21 0 bottom
C10  85.9,40.18 0 bottom
C11  76.4,84.99 0 top
C12  81.89,85.9 90 top
C13  101.24,74.35 270 bottom
C14  99.75,82.04 180 bottom
C15  87.93,74.35 90 bottom
C16  89.2,82.04 0 bottom
C17  106.98,81.23 180 bottom
C18  119.63,66.67 90 bottom
C19  119.84,81.23 0 bottom
C20  112.19,77.52 0 bottom
C21  113.08,67.18 270 bottom
C22  106.45,87.63 270 top
C23  106.45,75.13 90 top
C24  127.91,87.63 270 top
C25  128.75,78.26 0 top
C26  114.48,79.1 90 top
C27  40.33,7.09 90 top
C28  40.33,35.69 270 top
C29  31.57,13.82 0 top
C30  41.17,16.16 0 top
C31  41.17,27.69 0 top
C32  69.09,55.75 270 bottom
C33  66.17,55.75 270 bottom
C34  72.26,55.75 270 bottom
C35  75.56,55.75 270 bottom
C36  80.14,47.37 270 bottom
C37  80.14,41.4 90 bottom
C38  77.22,39.83 270 top
C39  87.73,27.74 0 top
C40  77.22,49.63 270 top
C41  77.93,27.74 180 top
C42  35.56,60.35 90 bottom
C43  28.6,81.46 0 top
C44  36.75,76.89 90 top
C45  35.56,55.63 270 bottom
C46  46.81,57.48 270 top
C47  22.35,73.99 180 top
C48  18.64,73.99 180 top
C49  24.96,67.36 90 top
C50  14.86,73.99 180 top
C51  24.98,62.64 270 top
C52  17,29.04 0 top
C53  14.92,34.39 0 top
C55  8.65,39.71 270 top
C56  54.67,18.47 90 top
C57  73,25.48 90 bottom
C58  83.19,46.13 90 bottom
C59  95,43.87 270 bottom
C60  80.14,53.26 90 bottom
CHANNEL_INPUT  134.49,47.74 270 top
D1  49.73,26.04 0 bottom
D2  30.93,26.04 180 bottom
D3  49.66,38.04 180 bottom
D4  30.91,38.03 180 bottom
D5  110.62,90.68 180 bottom
F1  97.1,76.15 270 bottom
F2  91.9,76.15 270 bottom
F3  119.2,74.47 180 bottom
GAP1  49.79,42.34 180 top
GAP2  30.93,42.3 180 top
GAP3  30.93,29.6 180 top
GAP4  49.73,29.6 0 top
GPS  44.9,5.21 180 bottom
IC1  88.9,33.91 270 bottom
IC2  82.19,93.57 180 bottom
IC3  108.86,71.09 0 bottom
IC4  120.7,76.35 270 top
IC5  38.43,21.85 180 top
IC6  70.99,44.45 270 bottom
IC7  70.33,44.75 180 top
IC8  82.83,20.98 270 top
IC9  39.4,61.11 270 top
IC10  33.02,77.32 90 top
IC11  19.86,65.66 180 top
IC12  15.01,40.75 180 top
IC13  51.9,18.88 90 top
IC14  75.49,25.48 180 bottom
IC15  OP07CR  [SO08']  88.93,46.96 270 bottom
LED_GPS  66.24,4.13 180 top
MODGPS1  21.59,49.78 0 top
PROG  49.02,88.72 270 top
R1  111.4,51.69 0 bottom
R2  115.21,50.57 0 bottom
R3  111.4,54.99 0 bottom
R4  115.21,56.08 0 bottom
R5  111.4,41.53 0 bottom
R6  115.21,40.41 0 bottom
R7  111.4,45.21 0 bottom
R8  115.21,46.33 0 bottom
R9  111.4,32 0 bottom
R10  115.21,30.91 0 bottom
R11  111.4,35.56 0 bottom
R12  115.21,36.65 0 bottom
R13  111.4,22.99 0 bottom
R14  115.21,21.84 0 bottom
R15  111.4,26.16 0 bottom
R16  115.21,27.25 0 bottom
R17  85.27,25.48 90 bottom
R18  86.97,25.48 90 bottom
R19  88.6,25.48 90 bottom
R20  88.11,50.77 0 bottom
R21  72.42,30.43 90 bottom
R22  69.19,30.43 90 bottom
R23  80.14,35.05 270 bottom
R24  67.54,30.43 270 bottom
R25  65.91,30.4 270 bottom
R26  18.77,82.7 270 top
R27  33.93,82.3 270 top
R28  38.51,81.46 0 top
R29  49.66,44.39 180 bottom
R30  49.23,55.78 270 top
R31  30.93,44.33 180 bottom
R32  49.73,31.63 0 bottom
R33  51.96,14.45 180 top
R34  55.3,68.17 0 top
R35  55.3,66.24 0 top
R36  55.3,62.43 0 top
R37  55.3,60.63 0 top
R38  55.3,58.8 0 top
R39  55.3,56.95 0 top
R40  55.3,55.12 0 top
R42  70.79,30.43 90 bottom
R43  55.3,64.36 0 top
R44  73.99,30.43 270 bottom
R45  78.28,25.48 270 bottom
R46  83.19,51.23 270 bottom
R47  94.95,49.15 270 bottom
R48  19.23,47.3 90 top
R49  19.83,57.53 270 top
R50  16.64,48.67 90 top
R51  17.14,56.92 270 top
R52  32.08,72.11 270 top
R53  65.05,72.11 270 top
RST  28.68,91.36 270 top
SERIAL  6.6,62.38 90 top
SHIELD1  99.19,14.99 0 bottom
USB  14.66,24.46 180 top
VINPUT  117.09,90.35 0 top
XTAL  42.74,57.96 90 bottom

### Tracks (layer width: path | path; a pad name or v marks a point on that pad's centre or on a via)
1PPS_0
  Bottom 0.406: R32.2 47.7,31.63 GAP4.1 45.67,23.68 47.71,21.63 GPS.7
1PPS_1  (via drill 0.3 pad 0.64)
  Top 0.406: v52.83,22.15 52.83,20.19 IC13.1
  Bottom 0.406: R32.1 50.68,30.69 47.62,27.63 D1.K 47.62,24.14 48.92,22.84 52.15,22.84 v52.83,22.15
+3V3  (via drill 0.3 pad 0.64)
  Top 0.406: IC4.1 C26.1 110.82,78.25 | 110.82,78.25 106.56,78.25 C23.+ 77.55,78.13 77.55,78.11 v75.36,75.92 | IC8.1 78.78,25.43 C41.1 80.19,27.74 82.83,25.09 82.83,16.31 84.58,14.55 118.85,14.55 v125.53,21.23 | 110.82,78.25 110.8,78.22 110.8,70.87 128.83,52.83 v128.83,44.04 | IC10.5 33.99,76.04 C44.1 39.1,76.04 v41.58,78.51 41.58,80.37 40.49,81.46 R28.2 | v55.5,78.54 62.77,71.26 R53.2 68.82,71.26 v69.75,70.33 72.97,67.11 72.97,58.83 77.22,54.59 C40.1 76.57,51.13 75.06,51.13 74.78,50.85 IC7.1 | IC11.16 C51.1 24.99,63.48 v27.08,63.48
  Bottom 0.406: v69.75,70.33 75.34,75.92 v75.36,75.92 | v55.5,78.54 41.6,78.54 v41.58,78.51 29.08,78.51 27.08,76.5 v27.08,63.48 | v125.53,21.23 128.83,24.54 v128.83,44.04
+5V  (via drill 0.3 pad 0.64)
  Top 0.406: C24.+ 127.9,84.62 | 127.9,84.62 C25.1 IC4.8 | C29.+ 34.57,12.32 36.8,10.09 C27.+ | C27.+ 40.32,10.11 C30.1 40.33,16.17 IC5.8 | C24.+ | C24.+ 132.79,84.63 140.54,76.89 140.54,19.02 131.61,10.09 C27.+ | v75.69,89.85 77.88,87.66 C11.+ 81.83,84.99 C12.1 84.16,85.05 IC2.+VIN 84.33,85.9 87.5,89.08 100.15,89.08 104.6,84.63 C22.+ 127.89,84.63 127.9,84.62
  Bottom 0.406: v75.69,89.85 76.46,89.08 D5.K | D5.K | D5.K VINPUT.1 | VINPUT.1
+5V/1  (via drill 0.3 pad 0.64)
  Top 0.406: v113,59.99 106.96,66.04 89.99,66.04 v82.04,58.09 | v82.07,34.37 82.07,40.66 | IC7.16 75.3,40.68 C38.1 77.23,40.66 82.07,40.66 | IC8.16 86.88,25.97 C39.1 86.88,29.55 v82.07,34.37 | v82.07,34.37 75.69,34.37 73.38,32.05 73.38,27.28 71.45,25.35 v70.56,25.35 | 82.07,40.66 82.07,58.09 v82.04,58.09 | v78.89,61.09 79.05,61.09 v82.04,58.09
  Bottom 0.406: F3.3 122.6,70.79 121.49,69.67 C18.+ 118.24,69.67 116.53,67.97 116.53,61.59 114.94,59.99 v113,59.99 | IC6.28 68.2,51.38 69.09,52.27 C32.+ C33.+ 64.82,54.28 63.75,55.35 63.75,59.79 65.05,61.09 v78.89,61.09 | IC6.27 69.77,50.11 72.26,52.6 C34.+ C35.+ 78.23,54.28 v82.04,58.09 | 73.05,24.68 C57.1 | R23.2 82.07,34.2 v82.07,34.37 | 73.05,24.68 IC14.5 | 73.05,24.68 71.23,24.68 v70.56,25.35
+15V  (via drill 0.3 pad 0.64)
  Top 0.406: v85.19,51.41 95.25,61.47 v104.39,61.47 104.39,48.23 v95,38.84 95.02,38.81 v95.02,26.44
  Bottom 0.406: F1.3 97.23,72.87 C13.+ | C13.+ 103.2,72.87 104.29,73.97 104.29,77.27 105.46,78.44 108.97,78.44 109.98,79.45 C17.+ C19.+ 116.84,78.48 115.88,77.52 C20.1 113.04,75.25 111.84,74.04 111.25,74.04 111.12,74.17 IC3.8 | R46.1 84.42,52.18 v85.19,51.41 | IC1.1 92.53,40.21 C9.1 93.62,40.21 v95,38.84 | v104.39,61.47 104.39,67.49 101.24,70.64 C13.+ | IC1.18 88.13,31.63 90.07,29.69 90.07,28.09 91.72,26.44 v95.02,26.44
-15V  (via drill 0.3 pad 0.64)
  Top 0.406: v86.77,41.6 86.77,44.27 v94.97,52.48
  Bottom 0.406: F2.3 91.78,72.87 C15.- 87.94,60.91 94.94,53.9 94.94,52.5 v94.97,52.48 94.97,50.12 R47.1 | IC1.27 86.51,37.48 86.75,37.73 C10.1 86.77,40.2 v86.77,41.6
AGND  (via drill 0.3 pad 0.64)
  Top 0.406: 85.83,16.59 85.88,16.54 IC8.9 | 84.15,16.97 84.18,16.99 84.18,18.24 | 88.37,16.54 89.13,16.54 89.89,17.3
  Top 0.813: 85.83,16.59 84.53,16.59 84.15,16.97
  Bottom 0.406: IC1.26 86.23,36.83 86.72,36.35 | IC1.25 83.93,36.18 83.82,36.3 84.38,36.85 85.29,36.85 | IC1.19 86.26,32.28 86.56,32.59 | IC1.20 84.04,32.93 83.97,32.87 83.97,32.54 84.25,32.26 85.27,32.26 | IC1.12 93.65,30.98 94.28,30.35 | 90.98,31.24 91.24,30.99 92.76,30.99 | IC14.3 77.04,26.28 77.04,27.36 | 81.36,54.63 80.85,54.13 79.63,54.13 78.64,53.14 | 66.29,42.52 67.08,42.52 67.84,41.76
  other vias: 107.7,23.62 107.7,28.96 107.7,42.67 107.7,48.51 107.7,58.17 111.51,38.61
  pour Top (isolate 0.508): 141.94,17.02 58.78,17.02 58.78,78.49 141.94,78.49
  pour Bottom (isolate 0.508): 141.94,77.72 141.94,17.04 140.28,15.39 124.89,0 99.36,0 58.78,0 58.78,65.38 58.78,95.5 80.59,95.5 124.89,95.5 141.86,78.54 141.94,78.46
AIN0
  Bottom 0.406: R1.2 110.55,50.91 110.29,50.65 C1.1 108.44,51.58 107.8,52.22 105.05,52.22 101.3,48.46 101.3,36.52 100.3,35.53 IC1.5
AIN1
  Bottom 0.406: R3.2 110.55,55.71 110.24,56.03 C2.1 108.44,54.65 107.64,53.85 104.8,53.85 100.58,49.63 100.58,36.93 99.84,36.18 IC1.4
AIN2
  Bottom 0.406: R5.2 110.55,40.76 110.26,40.46 C3.1 108.44,39.71 107.54,38.81 103.99,38.81 102.82,37.64 102.82,35.76 101.29,34.23 IC1.7
AIN3
  Bottom 0.406: R7.2 110.55,46.01 110.29,46.28 C4.1 108.46,46.27 108.46,45.16 107.7,44.4 104.39,44.4 102.06,42.06 102.06,36.22 100.72,34.88 IC1.6
AIN4
  Bottom 0.406: R9.2 110.55,31.2 110.29,30.94 C5.1 108.41,30.97 108.41,32.16 107.63,32.93 IC1.9
AIN5
  Bottom 0.406: R11.2 110.55,36.36 110.31,36.6 C6.1 108.46,36.59 108.46,34.54 107.5,33.58 IC1.8
AIN6
  Bottom 0.406: R13.2 110.55,22.21 110.24,21.89 C7.1 108.51,21.83 108.51,20.22 108,19.71 105.72,19.71 100.53,24.89 100.53,30.99 99.89,31.63 IC1.11
AIN7
  Bottom 0.406: R15.2 110.55,26.91 110.26,27.2 C8.1 | IC1.10 100.81,32.28 102.06,31.04 102.06,26.87 103.99,24.94 107.85,24.94 108.44,25.54 C8.1 | C8.1 108.41,27.17
AOUT
  Bottom 0.406: IC1.2 90.46,37.48 88.95,38.99 88.95,45.36 89.92,46.33 IC15.3
AUX_OUT
  Top 0.406: IC9.2 32.64,67.46 28.14,71.96 28.14,76.07 22.36,81.85 R26.2
CHANNEL0
  Bottom 0.406: R1.1 112.25,50.91 112.6,50.57 R2.2 114.36,51.6 115.11,52.35 116.66,52.35 127.24,62.93 132.16,62.93 134.11,62.93 CHANNEL_INPUT.14
CHANNEL1
  Bottom 0.406: R3.1 112.25,55.77 112.57,56.08 R4.2 114.36,54.98 115.19,54.15 116.64,54.15 126.78,64.3 CHANNEL_INPUT.1
CHANNEL2
  Bottom 0.406: R5.1 112.25,40.76 112.6,40.41 R6.2 114.36,41.54 115.24,42.42 118.21,42.42 119.99,44.2 119.99,51.66 128.49,60.16 132.26,60.16 134.09,60.16 CHANNEL_INPUT.15
CHANNEL3
  Bottom 0.406: R7.1 112.25,46.01 112.57,46.33 R8.2 114.36,45.02 115.21,44.17 117.63,44.17 118.31,44.86 118.31,52.07 127.77,61.53 CHANNEL_INPUT.2
CHANNEL4
  Bottom 0.406: R9.1 112.25,31.2 112.55,30.91 R10.2 114.36,32.02 115.04,32.69 118.9,32.69 122.73,36.52 122.73,50.09 130.03,57.39 132.36,57.39 134.06,57.39 CHANNEL_INPUT.16
CHANNEL5
  Bottom 0.406: R11.1 112.25,36.31 112.6,36.65 R12.2 114.36,35.67 115.67,34.37 117.47,34.37 121.26,38.15 121.26,50.8 129.25,58.79 CHANNEL_INPUT.3
CHANNEL6
  Bottom 0.406: R13.1 112.25,22.11 112.52,21.84 R14.2 114.36,22.9 115.39,23.93 121.77,23.93 125.93,28.09 125.93,48.62 131.96,54.65 132.41,54.65 134.01,54.65 CHANNEL_INPUT.17
CHANNEL7
  Bottom 0.406: R15.1 112.25,26.96 112.55,27.25 R16.2 114.36,26.35 115.34,25.38 120.73,25.38 124.36,29.01 124.36,49.28 131.1,56.02 CHANNEL_INPUT.4
DGND  (via drill 0.3 pad 0.64)
  Top 0.305: 32.77,80.01 33.02,80.01 33.02,77.47 33.17,77.32 35.1,77.32 | 17.6,38.46 17.3,38.15 17.3,37.64 | 17.73,38.51 17.93,38.3 17.93,37.62 | IC12.25 17.28,35.9 17.45,35.74 | IC12.26 17.93,35.79 17.96,35.76 | 51.61,21.44 51.92,21.13 51.92,18.85
  Top 0.406: IC4.3 119.84,75.72 120.73,76.61 120.73,80.54 | C25.2 129.56,78.26 129.56,79.27 131.19,80.9 v133.1,80.9 | IC12.18 12.73,38.23 13.49,38.99 | IC12.7 15.33,42.89 14.76,42.32 | IC12.21 14.68,38.69 14.76,38.76 | 69.62,82.22 69.62,76.05 74.88,70.79 | 73.61,45.95 66.83,45.95 65.89,46.89 IC7.8 | 73.61,45.95 76.05,45.95 77.22,47.12 C40.2 78.86,48.78 79.4,49.33 79.4,56.19 74.88,60.71 74.88,70.79 | IC7.2 73.53,49.33 73.53,46.02 73.61,45.95 | 14.81,46.43 15.34,45.9 15.34,43.87 | 14.68,37.08 14.68,35.87 15.11,35.43 | C41.2 76.3,27.74 75.74,27.18 75.74,24.94 76.53,24.16 IC8.2 79.93,24.16 80.72,23.37 80.72,16.54 | 12.72,36.63 12.72,35.33 12.55,35.15 | 80.72,16.54 80.72,13.87 80.67,13.82 | 74.88,70.79 76.22,72.13 C23.- | 76.33,16.05 76.81,16.54 IC8.8 | IC8.8 80.72,16.54 | IC8.8 78.23,15.44
  Bottom 0.305: 42.42,9.91 42.67,9.91 42.67,7.62 | 42.67,5.84 42.67,7.62 | GPS.2 42.71,7.66 42.67,7.62
  Bottom 0.406: D5.A 112.7,92.28 113.13,92.71 118.49,92.71 119.59,91.61 VINPUT.2 124.92,89.08 v133.1,80.9 | 50.85,64.82 51.03,64.64 52.43,64.64 | 50.93,62.71 51.03,62.81 52.48,62.81
  pour Bottom (isolate 0.508): 0,76.2 0,78.46 6.78,85.24 17.04,95.5 33.27,95.5 57.71,95.5 57.71,83.16 57.71,0 55.83,0 16.99,0 -0.03,17.02 -0.03,76.17
  pour Top (isolate 0.508): 20.32,95.5 124.89,95.5 140.89,79.5 57.71,79.5 57.71,74.65 57.71,16.1 76.66,16.1 140.41,16.1 140.94,16.1 124.84,0 18.01,0 16.99,0 0.86,16.13 0,16.99 0,77.75 0,78.46 14.73,93.19 17.04,95.5
FT_RX
  Top 0.406: 16.64,44.38 IC12.5 16.63,47.81 R50.1
FT_TX
  Top 0.406: IC12.1 | IC12.1 R48.1
HW_RX  (via drill 0.3 pad 0.64)
  Top 0.406: IC9.18 41.43,56.03 39.01,53.62 38.94,53.54 38.73,53.34 38.73,46.89 37.24,45.39 v23.55,45.39 20.79,48.15 R48.2 | R49.2 v23.56,56.68 v23.57,56.67
  Bottom 0.406: v23.57,56.67 23.57,45.41 v23.55,45.39
HW_TX  (via drill 0.3 pad 0.64)
  Top 0.406: R51.2 17.14,55.38 17.7,54.81 29.77,54.81 v29.95,54.99 | IC9.17 42.93,54.76 40.72,52.55 40.72,45.64 v40.18,45.11 | R50.2 31.18,49.52 v31.52,49.86
  Bottom 0.406: v40.18,45.11 38.46,46.84 34.54,46.84 v31.52,49.86 29.95,51.44 v29.95,54.99
N$1
  Bottom 0.406: IC1.15 85.27,29.68 R17.2
N$2
  Bottom 0.406: IC1.16 86.23,30.33 86.97,29.59 R18.2
N$3
  Bottom 0.406: IC1.17 87.02,30.98 88.59,29.41 R19.2
N$4
  Bottom 0.406: IC6.24 68.73,46.3 72.42,42.62 R21.2
N$5
  Top 0.406: RST.2 29.95,85.52 32.32,83.15 R27.1 36.82,83.15 37.66,82.31 R28.1
N$6
  Bottom 0.406: IC6.22 67.26,43.76 69.19,41.83 R22.2
N$7
  Bottom 0.406: IC6.2 77.5,50.11 79.8,52.41 C60.1 80.63,52.41 81.92,53.7 85.9,53.7 87.26,52.34 R20.2
N$8
  Top 0.406: IC10.4 32.07,72.97 R52.1
N$9
  Top 0.406: IC10.1 33.97,81.41 R27.2 30.09,81.45 C43.+
N$10
  Top 0.406: IC12.4 17.28,42.86 14.98,40.56 12.17,40.56 | C55.1 12.17,40.56 | IC12.17 12.08,40.47 12.17,40.56
N$11
  Top 0.406: IC11.1 23.2,68.73 C47.1
N$12
  Bottom 0.406: IC6.12 77.7,37.41 79.21,35.9 R23.1
N$13
  Bottom 0.406: IC6.15 67.11,34.87 67.54,34.44 R24.1
N$14
  Bottom 0.406: IC6.16 64.34,36.14 64.08,35.89 64.08,31.83 64.66,31.25 R25.1
N$15
  Top 0.406: IC11.3 20.62,71.48 21.5,72.35 C47.2
N$16
  Top 0.406: IC11.4 19.36,72.52 19.53,72.69 19.53,73.95 C48.1
N$17
  Bottom 0.406: IC6.6 78.16,45.03 79.02,45.9 C36.+
N$18
  Bottom 0.406: IC6.7 78.16,43.76 79.04,42.88 C37.+
N$19
  Top 0.406: IC11.5 18.09,72.47 17.79,72.76 C48.2
N$20
  Top 0.406: R26.1 18.72,83.6 AUX.2
N$21
  Top 0.406: IC9.21 47.37,59.84 49.23,57.99 R30.1
N$22  (via drill 3.68 pad 7.11)
  other vias: 5.08,90.42
N$23  (via drill 3.68 pad 7.11)
  other vias: 5.08,5.08
N$25  (via drill 3.68 pad 7.11)
  other vias: 137.41,5.08
N$26  (via drill 0.3 pad 0.64)
  Top 0.406: R33.1 52.81,14.4 54.05,14.4 v55.91,12.55
  Bottom 0.406: v55.91,12.55 58.12,10.34 63.04,10.34 64.97,8.41 LED_GPS.2
N$27
  Top 0.406: IC13.4 50.95,14.45 R33.2
N$28
  Top 0.406: IC7.3 72.24,57.17 61.24,68.17 R34.2
N$29
  Top 0.406: IC7.4 70.97,55.93 60.66,66.24 R35.2
N$30
  Top 0.406: IC7.6 68.43,53.85 59.84,62.43 R36.2
N$31
  Top 0.406: IC8.3 66.45,22.89 63.55,25.78 63.55,56.41 59.33,60.63 R37.2
N$32
  Top 0.406: R38.2 58.6,58.8 62.08,55.32 62.08,24.43 64.9,21.61 IC8.4
N$33
  Top 0.406: R39.2 58.09,56.95 60.45,54.59 60.45,25.2 60.45,23.5 63.6,20.34 IC8.5
N$34
  Top 0.406: IC8.6 62.69,19.07 58.78,22.99 58.78,53.37 57.02,55.12 R40.2
N$35  (via drill 3.68 pad 7.11)
  other vias: 137.41,90.42
N$37
  Bottom 0.406: IC15.4 94.72,45.06 C59.- 94.94,45.39 R47.2
N$38
  Top 0.406: IC11.2 21.89,67 22.39,66.51 C49.1
N$39
  Bottom 0.406: IC2.+VOUT 97.1,84.89 97.1,82.04 | F1.1 97.1,81.97 97.1,82.04 | 97.1,82.04 C14.1
N$40
  Bottom 0.406: F2.1 91.95,79.55 91.95,81.99 91.95,82.04 | 91.95,82.04 IC2.-VOUT | 91.95,82.04 C16.1
N$41
  Bottom 0.406: IC6.23 68,45.03 70.79,42.24 R42.2
N$42
  Bottom 0.406: IC3.1 111.15,68.02 111.16,68.03 C21.1 113.08,70.31 115.8,73.03 F3.1
N$43
  Top 0.406: IC7.5 69.7,55.02 60.35,64.36 R43.2
N$44
  Bottom 0.406: IC14.4 76.19,24.63 R45.2
N$45
  Bottom 0.406: IC15.7 C58.+ R46.2
N$46
  Bottom 0.406: IC6.13 74.7,36.14 73.99,35.43 R44.1
N$47
  Bottom 0.406: IC15.2 89.53,47.6 88.94,47 | 88.94,47 88.27,46.33 IC15.6 | R20.1 88.94,50.75 88.94,47
N$51
  Top 0.406: IC11.6 16.82,71.93 15.71,73.04 C50.1
OSC1  (via drill 0.3 pad 0.64)
  Top 0.406: IC9.9 32.38,58.57 31.95,59 v31.95,59.13
  Bottom 0.406: XTAL.2 40.62,62.71 37.4,59.5 C42.1 32.32,59.5 v31.95,59.13
OSC2  (via drill 0.3 pad 0.64)
  Top 0.406: IC9.10 32.31,57.3 31.95,56.95 v31.95,56.82
  Bottom 0.406: XTAL.1 41.27,53.21 38.01,56.48 C45.1 32.3,56.48 v31.95,56.82
PGC
  Top 0.406: IC9.27 46.56,67.46 50.29,71.2 PROG.4
PGD  (via drill 0.3 pad 0.64)
  Top 0.406: IC9.28 45.7,68.73 48.67,71.7 v48.67,75.03 | v52.83,75.08 PROG.5
  Bottom 0.406: v48.67,75.03 52.78,75.03 v52.83,75.08
PIN0_A0  (via drill 0.3 pad 0.64)
  Top 0.406: IC8.14 v93.45,22.89
  Bottom 0.406: R19.1 91.71,24.63 v93.45,22.89
PIN0_A1  (via drill 0.3 pad 0.64)
  Top 0.406: IC8.13 v91.36,21.61
  Bottom 0.406: R18.1 86.97,22.07 IC8.13 v91.36,21.61
PIN0_A2  (via drill 0.3 pad 0.64)
  Top 0.406: v89.84,20.34 IC8.12
  Bottom 0.406: R17.1 85.27,21.44 86.36,20.34 v89.84,20.34
PIN0_BUSY
  Bottom 0.406: IC14.1 74.84,27.07 74.3,27.61 73.05,27.61 72.42,28.25 R21.1
PIN0_CLK  (via drill 0.3 pad 0.64)
  Top 0.406: v67.56,28.12 67.56,34.9 69.7,37.03 IC7.12
  Bottom 0.406: R24.2 67.56,29.55 v67.56,28.12
PIN0_CS  (via drill 0.3 pad 0.64)
  Top 0.406: v70.79,28.09 70.79,33.27 72.24,34.72 IC7.14
  Bottom 0.406: R42.1 v70.79,28.09
PIN0_DATA  (via drill 0.3 pad 0.64)
  Top 0.406: v65.89,28.12 65.89,35.36 68.43,37.9 IC7.11
  Bottom 0.406: R25.2 65.89,29.53 v65.89,28.12
PIN0_RC  (via drill 0.3 pad 0.64)
  Top 0.406: v69.16,28.12 69.16,34.06 70.97,35.87 IC7.13
  Bottom 0.406: R22.1 69.16,29.55 v69.16,28.12
PIN0_READY  (via drill 0.3 pad 0.64)
  Top 0.406: IC8.11 90.78,19.07 v91.64,18.21
  Bottom 0.406: R45.1 80.99,26.33 82.88,24.43 82.88,20.4 85.06,18.21 v91.64,18.21
PIN0_SYNC
  Bottom 0.406: R44.2 74.76,29.58 75.49,28.85 IC14.2
PIN1_A0
  Top 0.406: IC9.24 48.49,63.65 50.42,61.72 50.42,61.27 51.05,60.63 R37.1
PIN1_A1
  Top 0.406: IC9.23 48.28,62.38 49.4,61.27 49.4,60.66 51.26,58.8 R38.1
PIN1_A2
  Top 0.406: IC9.22 47.5,61.11 51.66,56.95 R39.1
PIN1_CLK  (via drill 0.3 pad 0.64)
  Top 0.406: v30.71,64.92 IC9.4 | R43.1 53.03,64.36 v51.71,65.68
  Bottom 0.406: v30.71,64.92 34.54,68.76 48.13,68.76 51.21,65.68 v51.71,65.68
PIN1_CS
  Top 0.406: IC9.26 47.17,66.19 51.21,70.23 53.11,70.23 54.45,68.9 R34.1
PIN1_DATA  (via drill 0.3 pad 0.64)
  Top 0.406: v46.89,53.47 44.38,53.47 IC9.16 | R36.1 52.43,62.43 v51.77,61.77
  Bottom 0.406: v46.89,53.47 51.77,58.34 v51.77,61.77
PIN1_RC  (via drill 0.3 pad 0.64)
  Top 0.406: v29.13,68.66 31.6,66.19 IC9.3 | R35.1 53.67,66.24 v52.02,67.89
  Bottom 0.406: v29.13,68.66 33.3,72.82 47.09,72.82 v52.02,67.89
PIN1_READY  (via drill 0.3 pad 0.64)
  Top 0.406: R40.1 54.43,55.1 v54.43,52.63 | v49.07,64.9 44.38,64.9 IC9.25
  Bottom 0.406: v54.43,52.63 54.43,62.36 53.06,63.73 50.24,63.73 v49.07,64.9
RX_GPS_0
  Bottom 0.406: R29.2 51.79,44.39 GAP1.1 56.57,39.62 56.57,37.31 54.05,34.8 44.58,34.8 41.86,32.08 41.86,24.23 45.71,20.38 GPS.5
RX_GPS_1  (via drill 0.3 pad 0.64)
  Top 0.406: IC11.7 15.54,70.64 14.52,71.67 13.07,71.67 11.53,73.2 v11.53,76.45
  Bottom 0.406: D3.A2 51.44,40.33 48.71,43.06 R29.1 48.65,44.45 43.26,44.45 41.96,43.16 38.33,43.16 36.25,45.24 34.37,45.24 28.25,51.36 28.25,59 11.53,75.72 v11.53,76.45
RX_PC  (via drill 0.3 pad 0.64)
  Top 0.406: IC11.14 20.62,61.62 v22.53,59.72
  Bottom 0.406: v22.53,59.72 16.79,53.98 6.33,53.98 5.33,54.97 SERIAL.2
TTL_RX_GPS
  Top 0.406: IC9.13 16.61,53.49 15.54,54.56 IC11.10
TTL_RX_PC
  Top 0.406: IC11.11 16.82,58.95 17.14,58.63 R51.1
TTL_TX_GPS  (via drill 0.3 pad 0.64)
  Top 0.406: IC11.9 14.28,53.52 15.57,52.22 IC9.14 34.44,50.35 35.51,49.28 v36.25,49.28 | v49.2,50.88 49.23,50.9 R30.2
  Bottom 0.406: v49.2,50.88 48.44,50.88 44.78,47.22 41.15,47.22 39.09,49.28 v36.25,49.28
TTL_TX_PC
  Top 0.406: IC11.12 18.09,59.33 19.04,58.38 R49.1
TX_GPS_0
  Bottom 0.406: R31.2 32.97,44.33 GAP2.1 37.9,39.4 37.9,22.3 44.71,15.48 GPS.4
TX_GPS_1  (via drill 0.3 pad 0.64)
  Top 0.406: IC11.8 12.69,68.69 9.35,72.03 v9.35,76.43
  Bottom 0.406: R31.1 28.52,44.33 26.81,46.04 26.81,58.76 9.35,76.22 v9.35,76.43 | R31.1 29.97,44.32 | R31.1 29.98,42.94 32.69,40.24 D4.A2
TX_PC  (via drill 0.3 pad 0.64)
  Top 0.406: IC11.13 19.36,60.88 v19.56,60.68
  Bottom 0.406: SERIAL.3 19.07,59.84 19.56,60.33 v19.56,60.68
USBDM
  Top 0.406: IC12.16 11.43,28.77 13.39,26.82 USB.3
USBDP
  Top 0.406: IC12.15 10.78,24.52 USB.4
VGPS
  Top 0.406: IC5.1 40.32,24.94 C31.1 40.33,27.7 C28.+ | GAP3.1 38.09,32.69 C28.+ | C56.1 54.62,17.57 | C28.+ 46.68,32.69 57.35,22.02 57.35,18.95 56.02,17.62 C56.1 | IC13.5 53.06,17.58 54.63,17.58 arc90 C56.1
  Bottom 0.406: GAP3.1 33.04,27.64 D2.K 33.04,21.84 43.71,11.18 GPS.3
VPIC  (via drill 0.3 pad 0.64)
  Top 0.406: C46.1 46.57,58.57 IC9.20 40.56,58.57 39.52,59.61 39.52,68.94 47.75,77.17 47.75,79.93 v47.75,81.38 PROG.3 | R53.1 65.05,78.69 62.13,81.61 55.52,81.61 v55.5,81.58
  Bottom 0.406: v55.5,81.58 47.95,81.58 v47.75,81.38
VPP
  Top 0.406: R52.2 32.08,70 33.35,68.73 IC9.1 36.22,68.73 45.21,77.72 PROG.2
VUSB
  Top 0.406: IC12.20 14.03,34.43 arc90 C53.1 14.07,32.69 14.86,31.9 17.25,31.9 18.48,30.67 C52.+ 18.47,29.03 USB.1

### Text on the board
tPlace: +5V | RVRQ-OCT18 | D+ | D- | GND | VCC